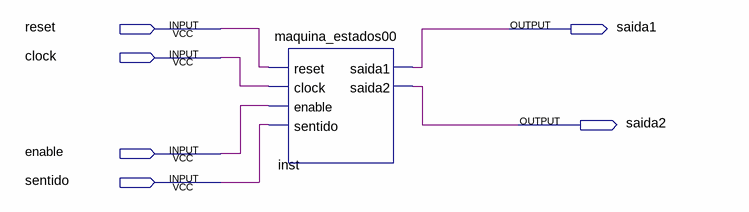
[diagram p0: schematic sheet]
// Quartus schematic Block1.bdf as structural Verilog: 1 symbols, 6 pins
module Block1 (
  input  reset,
  input  clock,
  input  enable,
  input  sentido,
  output saida1,
  output saida2
);

  maquina_estados00 inst (
    .reset(reset), .clock(clock), .enable(enable), .sentido(sentido), .saida1(saida1), .saida2(saida2));
endmodule
